# Altium schematic sheet BandPassFilter.SchDoc
size A; SheetNumber: 2; SheetTotal: 2
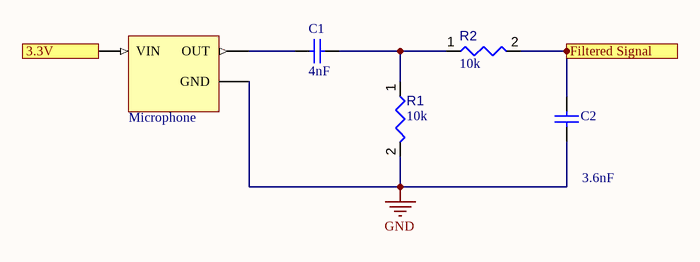
[diagram p0: BandPassFilter.SchDoc]

## Parts
C1  4nF  [CAPC1812(4532)230_M]
C2  3.6nF  [CAPC1812(4532)230_M]
R1  value 10k  [RESC1608X55X25ML10T15]  (hidden comment: Resistor 10k +/-1% 0603 100 mW)
R2  value 10k  [RESC1608X55X25ML10T15]  (hidden comment: Resistor 10k +/-1% 0603 100 mW)
U?  Microphone  [TI-YDC4]

## Ports
3.3V, Filtered Signal

## Nets
GND: C2.2 R1.2 U?.A1(GND)
3.3V: U?.B1(VIN) ; port 3.3V
Filtered Signal: C2.1 R2.2 ; port Filtered Signal
NetC1_1: C1.1 U?.A2(OUT)
NetC1_2: C1.2 R1.1 R2.1

## Library data of the parts
C1 C2 = CMP-1040-01257-2: CAP 82nF 50V ±5% 1812 (4532 Metric) Thickness 2.3mm SMD; Tolerance: Â±5%; Case-Metric: 4532; Case-EIA: 1812; Technology: SMT; Rated Voltage: 50 V; Max Thickness: 2.3 mm; Value: 82nF
R1 R2 = CMP-009-00017-5: Chip Resistor, 10 KOhm, +/- 1%, 01 W, -55 to 155 degC, 0603 (1608 Metric); Voltage Rating: 50V; Power: 100mW; RoHS Compliant: True; Min Operating Temperature: -55°C; Pins: 2; Case/Package: 0603; Mounting Technology: SM; Max Operating Temperature: 155°C; Tolerance: 1%
U? = CMP-0984-00011-1: Amplifier for High-Gain Two-Wire Microphone, -40 to 85 degC, 4-pin BGA (YDC4), Green (RoHS & no Sb/Br); Manufacturer: Texas Instruments; PartNumber: TLV1012-15YDCR; Vmin(V): 2; Vmax(V): 5; SubFamily: Microphone Preamplifier; DatasheetVersion: SLCS154A; Eco-Plan: Green (RoHS & no Sb/Br); ComponentLink2Description: Datasheet; PackageDescription: 4-Ball Silicon Grid Array, Body 1.117 x 1.117 mm, Pitch 0.5 mm; Mounting Technology: Surface Mount; ComponentLink1URL: http://www.ti.com/; ComponentLink2URL: http://www.ti.com/general/docs/lit/getliterature.tsp?genericPartNumber=TLV1012&fileType=pdf; ComponentLink3Description: Package Specification; PackageReference: YDC4; PackageVersion: 4208096/C, 07/2008; ComponentLink1Description: Manufacturer URL; ComponentLink3URL: http://www.ti.com/lit/ml/mxbg068b/mxbg068b.pdf